# EAGLE design abxy (EAGLE 9.1.0)
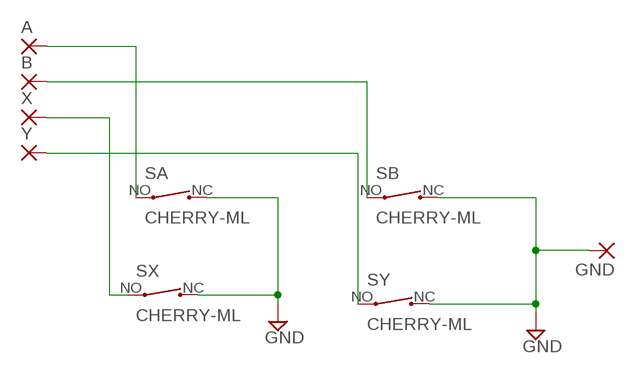
[diagram p0: schematic, sheet 1]

## Parts
A  3,81/1,3  [3,81/1,3]
B  3,81/1,3  [3,81/1,3]
GND  2,15/1,0  [2,15/1,0]
SA  CHERRY-ML  [CHERRY-ML]
SB  CHERRY-ML  [CHERRY-ML]
SX  CHERRY-ML  [CHERRY-ML]
SY  CHERRY-ML  [CHERRY-ML]
X  3,81/1,3  [3,81/1,3]
Y  3,81/1,3  [3,81/1,3]

## Nets
GND: GND.1(P) SA.NC SB.NC SX.NC SY.NC
N$1: A.1(P) SA.NO
N$2: B.1(P) SB.NO
N$3: SX.NO X.1(P)
N$4: SY.NO Y.1(P)

## Library data of the parts
A B X Y = wirepad:3,81/1,3: THROUGH-HOLE PAD
GND = wirepad:2,15/1,0: THROUGH-HOLE PAD
SA SB SX SY = wiip:CHERRY-ML

## Board
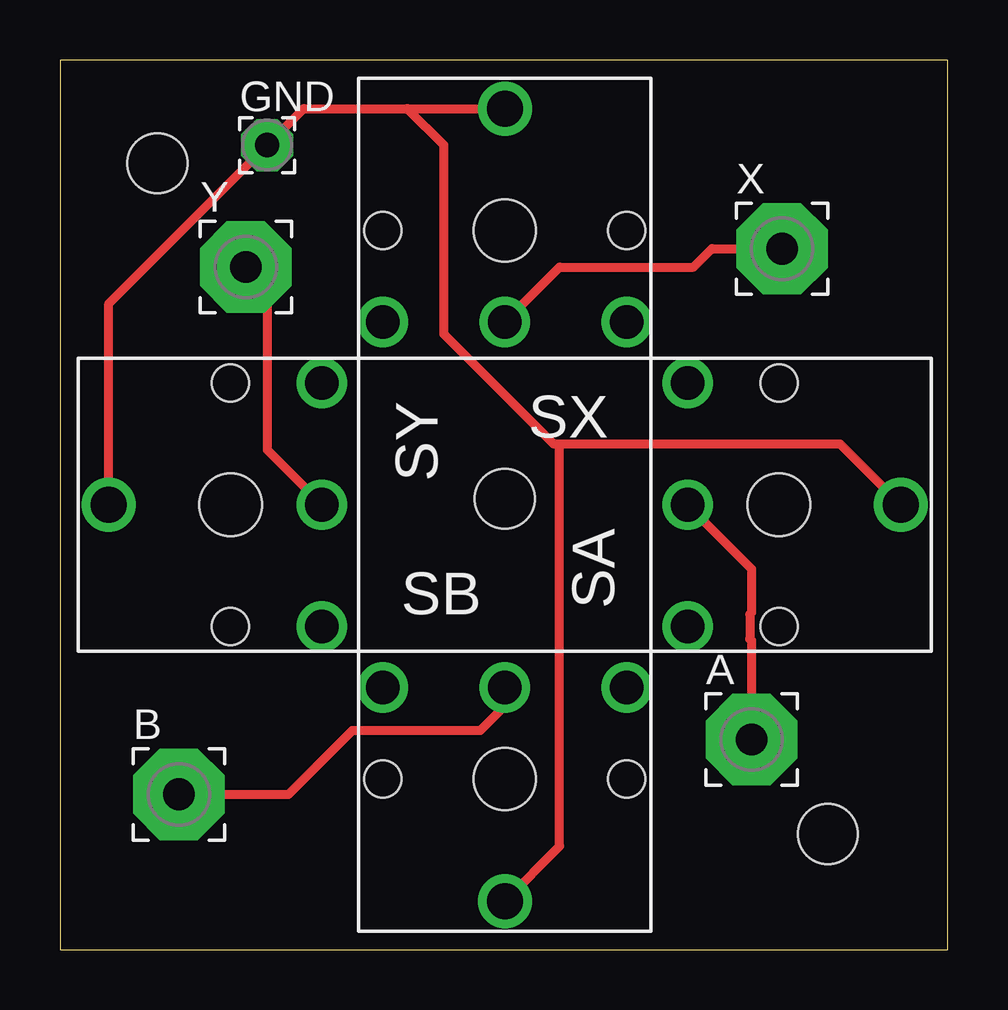
[diagram p1: board, top side]

Size 37.01 x 37.07 mm. Coordinates in mm from the lower left corner, seen from the top.
Outline: 0,0 37.01,0 37.01,37.07 0,37.07 0,0
Copper layers (1*16): Top 0.035mm / dielectric 1.5mm / Bottom 0.035mm
Design rules "oshpark": minimum track width 7mil, minimum drill 10mil, track to track 7mil, track to pad 7mil, pad to pad 7mil, via to via 7mil, smd to smd 6mil, copper to edge 10mil, drill to drill 6mil, minimum pad ring 10mil, minimum via ring 10mil, stop-mask expansion 2mil, vias tented up to drill 0mil, thermal gap 10mil
Holes 2.49 mm at 4.06,32.77 32,4.83 18.54,18.8

### Footprints (pad centres in the part's own frame; a part is rotated, then mirrored left to right if it is on the bottom)
3,81/1,3 = drill 1.321 pad 3.81 octagon: 1 0,0
2,15/1,0 = drill 1.016 pad 2.159 octagon: 1 0,0
CHERRY-ML = drill 1.5: NC 0,-5.08 | drill 1.4: NO 0,3.81; P$1 -5.08,3.81; P$2 5.08,3.81 | hole 1.55: -5.08,0; 5.08,0 | hole 2.6: 0,0

### Placement (x,y rotation side)
A  28.83,8.76 0 top
B  4.95,6.48 0 top
GND  8.64,33.53 0 top
SA  29.97,18.54 90 top
SB  18.54,7.11 0 top
SX  18.54,29.97 180 top
SY  7.11,18.54 270 top
X  30.1,29.21 0 top
Y  7.75,28.45 0 top

### Tracks (layer width: path | path; a pad name or v marks a point on that pad's centre or on a via)
GND
  Top 0.381: SY.NC 2.03,26.92 GND.1 10.16,35.05 14.48,35.05 | 14.48,35.05 SX.NC | SA.NC 32.51,21.08 20.83,21.08 | 20.83,21.08 20.57,21.08 16,25.65 16,33.53 14.48,35.05 | SB.NC 20.83,4.32 20.83,21.08
N$1
  Top 0.381: SA.NO 28.83,15.88 28.83,14.04 28.75,13.97 28.75,12.96 28.83,12.88 A.1
N$2
  Top 0.381: B.1 9.53,6.48 12.19,9.14 17.53,9.14 18.54,10.16 SB.NO
N$3
  Top 0.254: 29.97,29.21 X.1
  Top 0.381: SX.NO 20.83,28.45 26.42,28.45 27.18,29.21 29.97,29.21
N$4
  Top 0.254: Y.1 7.75,26.8
  Top 0.381: Y.1 8.64,27.56 8.64,20.83 SY.NO